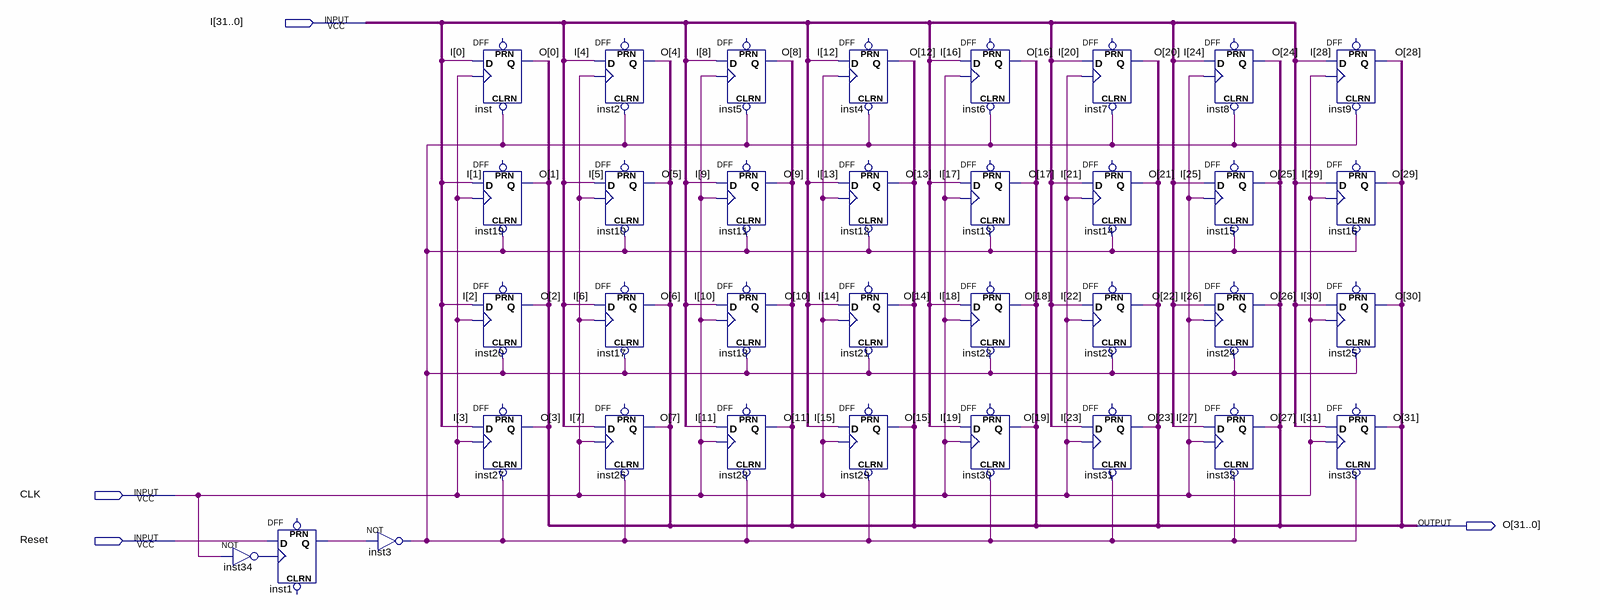
[diagram p0: schematic sheet]
// Quartus schematic register32_clr.bdf as structural Verilog: 35 symbols, 4 pins
module register32_clr (
  input  [31:0] I,
  input  CLK,
  input  Reset,
  output [31:0] O
);

  wire inst1_q, inst3_out, inst34_out;

  not inst34 (inst34_out, CLK);
  DFF inst1 (.CLK(inst34_out), .D(Reset), .Q(inst1_q));  // open: CLRN, PRN
  not inst3 (inst3_out, inst1_q);
  DFF inst (.CLRN(inst3_out), .CLK(CLK), .D(I[0]), .Q(O[0]));  // open: PRN
  DFF inst19 (.CLRN(inst3_out), .CLK(CLK), .D(I[1]), .Q(O[1]));  // open: PRN
  DFF inst20 (.CLRN(inst3_out), .CLK(CLK), .D(I[2]), .Q(O[2]));  // open: PRN
  DFF inst27 (.CLRN(inst3_out), .CLK(CLK), .D(I[3]), .Q(O[3]));  // open: PRN
  DFF inst2 (.CLRN(inst3_out), .CLK(CLK), .D(I[4]), .Q(O[4]));  // open: PRN
  DFF inst10 (.CLRN(inst3_out), .CLK(CLK), .D(I[5]), .Q(O[5]));  // open: PRN
  DFF inst17 (.CLRN(inst3_out), .CLK(CLK), .D(I[6]), .Q(O[6]));  // open: PRN
  DFF inst26 (.CLRN(inst3_out), .CLK(CLK), .D(I[7]), .Q(O[7]));  // open: PRN
  DFF inst5 (.CLRN(inst3_out), .CLK(CLK), .D(I[8]), .Q(O[8]));  // open: PRN
  DFF inst11 (.CLRN(inst3_out), .CLK(CLK), .D(I[9]), .Q(O[9]));  // open: PRN
  DFF inst18 (.CLRN(inst3_out), .CLK(CLK), .D(I[10]), .Q(O[10]));  // open: PRN
  DFF inst28 (.CLRN(inst3_out), .CLK(CLK), .D(I[11]), .Q(O[11]));  // open: PRN
  DFF inst4 (.CLRN(inst3_out), .CLK(CLK), .D(I[12]), .Q(O[12]));  // open: PRN
  DFF inst12 (.CLRN(inst3_out), .CLK(CLK), .D(I[13]), .Q(O[13]));  // open: PRN
  DFF inst21 (.CLRN(inst3_out), .CLK(CLK), .D(I[14]), .Q(O[14]));  // open: PRN
  DFF inst29 (.CLRN(inst3_out), .CLK(CLK), .D(I[15]), .Q(O[15]));  // open: PRN
  DFF inst6 (.CLRN(inst3_out), .CLK(CLK), .D(I[16]), .Q(O[16]));  // open: PRN
  DFF inst13 (.CLRN(inst3_out), .CLK(CLK), .D(I[17]), .Q(O[17]));  // open: PRN
  DFF inst22 (.CLRN(inst3_out), .CLK(CLK), .D(I[18]), .Q(O[18]));  // open: PRN
  DFF inst30 (.CLRN(inst3_out), .CLK(CLK), .D(I[19]), .Q(O[19]));  // open: PRN
  DFF inst7 (.CLRN(inst3_out), .CLK(CLK), .D(I[20]), .Q(O[20]));  // open: PRN
  DFF inst14 (.CLRN(inst3_out), .CLK(CLK), .D(I[21]), .Q(O[21]));  // open: PRN
  DFF inst23 (.CLRN(inst3_out), .CLK(CLK), .D(I[22]), .Q(O[22]));  // open: PRN
  DFF inst31 (.CLRN(inst3_out), .CLK(CLK), .D(I[23]), .Q(O[23]));  // open: PRN
  DFF inst8 (.CLRN(inst3_out), .CLK(CLK), .D(I[24]), .Q(O[24]));  // open: PRN
  DFF inst15 (.CLRN(inst3_out), .CLK(CLK), .D(I[25]), .Q(O[25]));  // open: PRN
  DFF inst24 (.CLRN(inst3_out), .CLK(CLK), .D(I[26]), .Q(O[26]));  // open: PRN
  DFF inst32 (.CLRN(inst3_out), .CLK(CLK), .D(I[27]), .Q(O[27]));  // open: PRN
  DFF inst9 (.CLRN(inst3_out), .CLK(CLK), .D(I[28]), .Q(O[28]));  // open: PRN
  DFF inst16 (.CLRN(inst3_out), .CLK(CLK), .D(I[29]), .Q(O[29]));  // open: PRN
  DFF inst25 (.CLRN(inst3_out), .CLK(CLK), .D(I[30]), .Q(O[30]));  // open: PRN
  DFF inst33 (.CLRN(inst3_out), .CLK(CLK), .D(I[31]), .Q(O[31]));  // open: PRN
endmodule
